# Altium project LimeSDR-Micro_M.2_2280_1v2.PrjPcb (part 10 of 10)
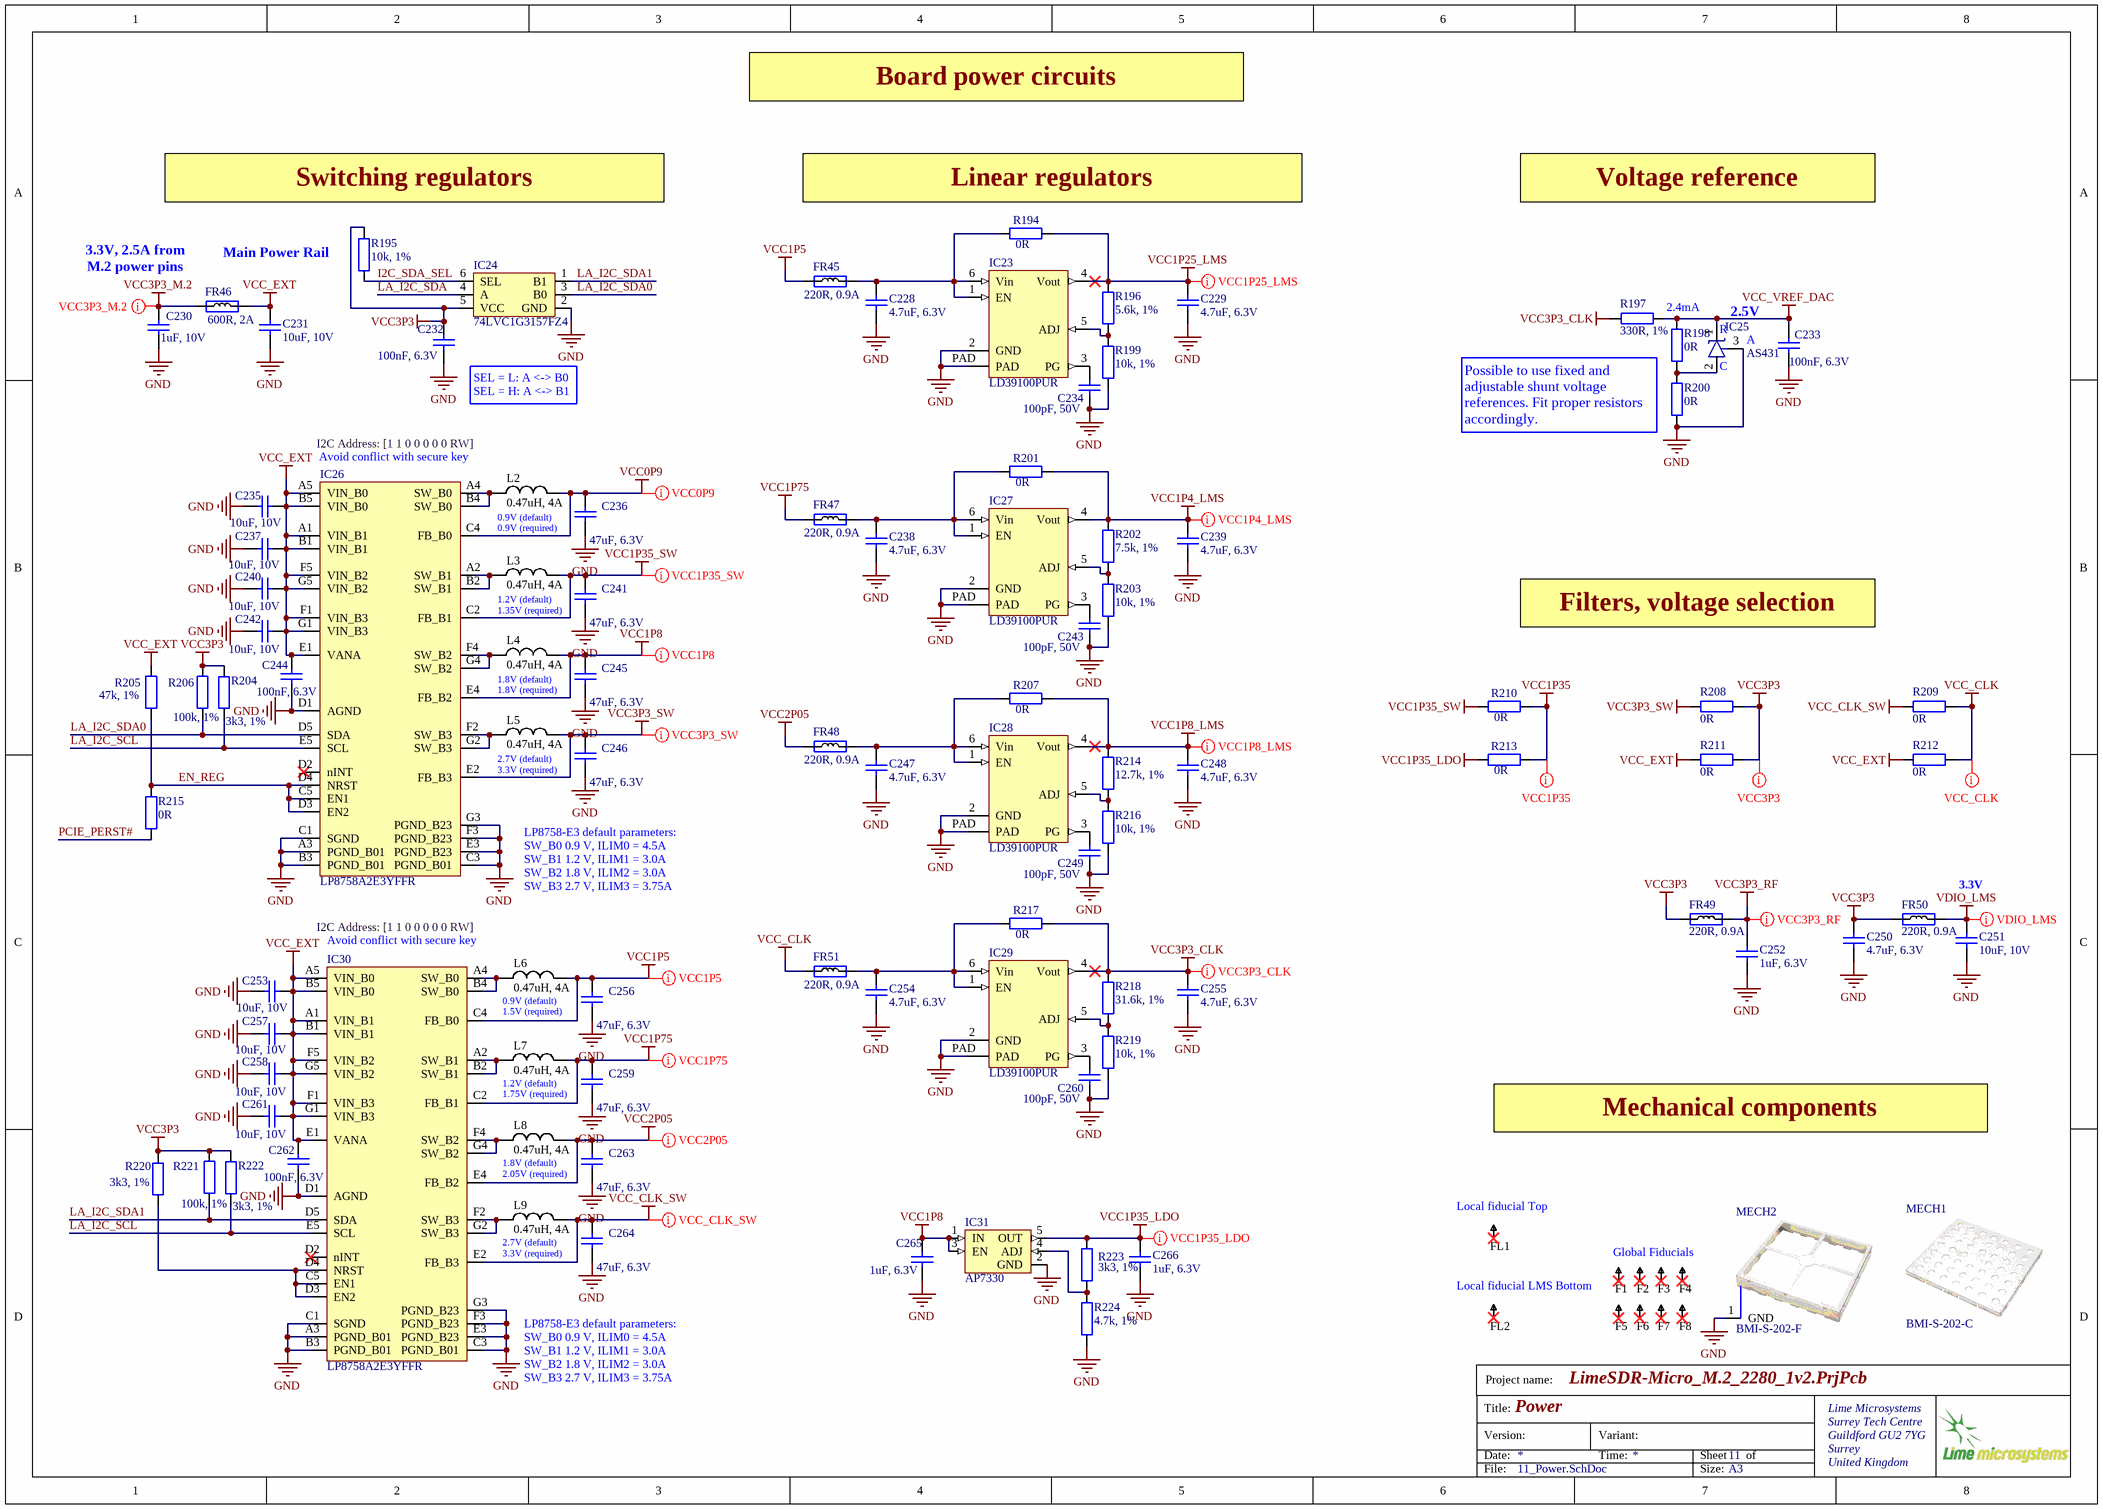
[diagram p108: 11_Power.SchDoc]

## Sheet 11_Power.SchDoc: Power (continued)

### Library data of the parts (continued)
R218 = Res_0402: Manufacturer: Yageo; Manufacturer Part Number 1: RC0201FR-0731K6L; Part Description: 31.6 kOhms ±1% 0.05W, 1/20W Chip Resistor 0201 (0603 Metric) Moisture Resistant Thick Film; Resistance: 31.6kR; Max Power Dissipation: 50mW; Temperature Coefficient: 200ppm/°C; Value: 31.6k, 1%; ComponentLink1URL: https://datasheet.ciiva.com/5924/1563626-5924912.pdf?src-supplier=Farnell; ComponentLink1Description: https://datasheet.ciiva.com/5924/1563626-5924912.pdf?src-supplier=Farnell; ComponentLink2URL: https://datasheet.ciiva.com/22661/1563626-22661319.pdf?src-supplier=Element14; ComponentLink2Description: https://datasheet.ciiva.com/22661/1563626-22661319.pdf?src-supplier=Element14; ComponentLink3URL: https://datasheet.ciiva.com/7660/1421516-7660807.pdf?src-supplier=Element14; ComponentLink3Description: https://datasheet.ciiva.com/7660/1421516-7660807.pdf?src-supplier=Element14; ComponentLink4URL: https://datasheet.ciiva.com/46391/1421516-46391339.pdf?src-supplier=Element14; ComponentLink4Description: https://datasheet.ciiva.com/46391/1421516-46391339.pdf?src-supplier=Element14; ComponentLink5URL: https://datasheet.ciiva.com/2467/pyu-r-int-thick-7-2467110.pdf?src-supplier=Digi-Key; ComponentLink5Description: https://datasheet.ciiva.com/2467/pyu-r-int-thick-7-2467110.pdf?src-supplier=Digi-Key; ComponentLink6URL: https://datasheet.ciiva.com/2467/pyu-r-int-thick-7-2467111.pdf?src-supplier=Digi-Key; ComponentLink6Description: https://datasheet.ciiva.com/2467/pyu-r-int-thick-7-2467111.pdf?src-supplier=Digi-Key; ComponentLink7URL: https://datasheet.ciiva.com/2467/pyu-r-int-thick-7-2467109.pdf?src-supplier=Digi-Key; ComponentLink7Description: https://datasheet.ciiva.com/2467/pyu-r-int-thick-7-2467109.pdf?src-supplier=Digi-Key; Supplier 1: Digi-Key; Supplier Part Number 1: YAG2597CT-ND; Stock 1: 255391; Pricing 1: 1=0,10000, 10=0,03700, 100=0,01500, 1000=0,00672, 2500=0,00583, 5000=0,00482 (USD); RoHS: Yes; Case/Package: 0201; Case Code (Metric): 0603; Case Code (Imperial): 0201; Min Operating Temperature: -55°C; Max Operating Temperature: 125°C; Packaging: Tape and Reel; Resistor Type: Thick Film; Number of Terminations: 2; Tolerance: 1%; Features: Moisture Resistant; Length: 0.024inch; Width: 0.012inch; Height: 0.01inch; RoHS Compliant: Yes; ComponentLink8URL: http://www.yageo.com/documents/recent/PYu-RC_Group_51_RoHS_L_10.pdf?src-supplier=Digi-Key; ComponentLink8Description: http://www.yageo.com/documents/recent/PYu-RC_Group_51_RoHS_L_10.pdf?src-supplier=Digi-Key; ComponentLink9URL: https://www.yageo.com/upload/media/product/productsearch/datasheet/rchip/PYu-RC_Group_51_RoHS_L_11.pdf?src-supplier=Digi-Key; ComponentLink9Description: https://www.yageo.com/upload/media/product/productsearch/datasheet/rchip/PYu-RC_Group_51_RoHS_L_11.pdf?src-supplier=Digi-Key; ComponentLink10URL: http://www.yageo.com/documents/recent/PYu-RC_Group_51_RoHS_L_9.pdf?src-supplier=Digi-Key; ComponentLink10Description: http://www.yageo.com/documents/recent/PYu-RC_Group_51_RoHS_L_9.pdf?src-supplier=Digi-Key
R224 = Res_0402: Manufacturer: Yageo; Manufacturer Part Number 1: RC0201FR-074K7L; Part Description: 4.7 kOhms ±1% 0.05W, 1/20W Chip Resistor 0201 (0603 Metric) Moisture Resistant Thick Film; Resistance: 4.7kR; Power Rating: 50mW; Voltage Rating: 25V; Temperature Coefficient: 200ppm/°C; Value: 4.7k, 1%; ComponentLink1URL: https://datasheet.ciiva.com/5924/1563626-5924912.pdf?src-supplier=Farnell; ComponentLink1Description: https://datasheet.ciiva.com/5924/1563626-5924912.pdf?src-supplier=Farnell; ComponentLink2URL: https://datasheet.ciiva.com/22661/1563626-22661319.pdf?src-supplier=Element14; ComponentLink2Description: https://datasheet.ciiva.com/22661/1563626-22661319.pdf?src-supplier=Element14; ComponentLink3URL: https://datasheet.ciiva.com/7672/1563626-7672202.pdf?src-supplier=Element14; ComponentLink3Description: https://datasheet.ciiva.com/7672/1563626-7672202.pdf?src-supplier=Element14; ComponentLink4URL: https://datasheet.ciiva.com/2493/pyu-r-int-thick-7-2493785.pdf?src-supplier=Digi-Key; ComponentLink4Description: https://datasheet.ciiva.com/2493/pyu-r-int-thick-7-2493785.pdf?src-supplier=Digi-Key; ComponentLink5URL: https://datasheet.ciiva.com/2493/pyu-r-int-thick-7-2493786.pdf?src-supplier=Digi-Key; ComponentLink5Description: https://datasheet.ciiva.com/2493/pyu-r-int-thick-7-2493786.pdf?src-supplier=Digi-Key; ComponentLink6URL: https://datasheet.ciiva.com/2493/pyu-r-int-thick-7-2493784.pdf?src-supplier=Digi-Key; ComponentLink6Description: https://datasheet.ciiva.com/2493/pyu-r-int-thick-7-2493784.pdf?src-supplier=Digi-Key; ComponentLink7URL: https://datasheet.ciiva.com/7672/1563626-7672233.pdf?src-supplier=Element14; ComponentLink7Description: https://datasheet.ciiva.com/7672/1563626-7672233.pdf?src-supplier=Element14; ComponentLink8URL: https://datasheet.ciiva.com/2493/pyu-r-int-thick-7-2493812.pdf?src-supplier=Digi-Key; ComponentLink8Description: https://datasheet.ciiva.com/2493/pyu-r-int-thick-7-2493812.pdf?src-supplier=Digi-Key; ComponentLink9URL: https://datasheet.ciiva.com/2493/pyu-r-int-thick-7-2493813.pdf?src-supplier=Digi-Key; ComponentLink9Description: https://datasheet.ciiva.com/2493/pyu-r-int-thick-7-2493813.pdf?src-supplier=Digi-Key; ComponentLink10URL: https://datasheet.ciiva.com/2493/pyu-r-int-thick-7-2493811.pdf?src-supplier=Digi-Key; ComponentLink10Description: https://datasheet.ciiva.com/2493/pyu-r-int-thick-7-2493811.pdf?src-supplier=Digi-Key; ComponentLink11URL: https://datasheet.ciiva.com/8892/pyu-rc0201-51-rohs-l-8-8892942.pdf?src-supplier=Avnet; ComponentLink11Description: https://datasheet.ciiva.com/8892/pyu-rc0201-51-rohs-l-8-8892942.pdf?src-supplier=Avnet; Supplier 1: Digi-Key; Supplier Part Number 1: 311-4.70KMCT-ND; Stock 1: 6149397; Pricing 1: 1=0,10000, 10=0,03700, 100=0,01530, 1000=0,00685, 2500=0,00595, 5000=0,00491 (USD); RoHS: Yes; Case/Package: 0201; Case Code (Metric): 0603; Case Code (Imperial): 0201; Weight: 6E-06oz; Contact Plating: Tin,Matte; Size Code: 0201; Min Operating Temperature: -55°C; Max Operating Temperature: 125°C; Tolerance: 1%; Packaging: Tape and Reel; Package Quantity: 1; Resistor Type: Thick Film; Number of Terminations: 2; Termination: SMD/SMT; Max Power Dissipation: 50mW; Features: Moisture Resistant; Series: RC; Resistance Tolerance: 1%; Construction: Rectangular; Length: 0.6mm; Width: 0.012inch; Height: 0.01inch; Depth: 0.3mm; Radiation Hardening: No; Military Standard: Not; Lead Free: Lead Free; RoHS Compliant: Yes

## Nets that join several sheets
GND: 05_LMS7002M_Misc (42 pins), 07_LMS7002M_Power (85 pins), 08_BB_Processor (131 pins), 09_Misc (75 pins), 10_Clock (81 pins), 11_Power (73 pins)
VCC0P9: 08_BB_Processor (16 pins), 11_Power (C236.2 IC26.C4 L2.2)
VCC1P4_LMS: 07_LMS7002M_Power (5 pins), 11_Power (C239.2 IC27.4 R201.2 R202.1)
VCC1P8: 08_BB_Processor (13 pins), 09_Misc (32 pins), 10_Clock (6 pins), 11_Power (6 pins)
VCC1P8_LMS: 07_LMS7002M_Power (11 pins), 10_Clock (FR40.1), 11_Power (C248.2 IC28.4 R207.2 R214.1)
VCC1P25_LMS: 07_LMS7002M_Power (18 pins), 11_Power (C229.2 IC23.4 R194.2 R196.1)
VCC1P35: 08_BB_Processor (C117.1 R75.2), 11_Power (R210.2 R213.2)
VCC3P3: 05_LMS7002M_Misc (X6.8), 08_BB_Processor (X7.8), 09_Misc (22 pins), 11_Power (13 pins)
VCC3P3_CLK: 08_BB_Processor (C133.2 C134.1 IC7.1), 10_Clock (20 pins), 11_Power (5 pins)
VCC3P3_M.2: 08_BB_Processor (R74.1), 09_Misc (5 pins), 11_Power (C230.2 FR46.1)
VCC_VREF_DAC: 10_Clock (R168.2), 11_Power (C233.1 IC25.1 R197.1 R198.1)
VDIO_LMS: 05_LMS7002M_Misc (9 pins), 07_LMS7002M_Power (R69.1), 11_Power (C251.2 FR50.2)
ADF_MUXOUT: 09_Misc (IC14.24), 10_Clock (IC21.15 R186.1)
EXT_CLK_CTRL: 09_Misc (IC14.22), 10_Clock (IC16.30)
EXT_PPS_SEL: 09_Misc (IC14.26), 10_Clock (IC19.6)
GNSS_1PPS: 09_Misc (IC11.6), 10_Clock (R176.1)
GNSS_RXD_LS: 08_BB_Processor (IC6.P9), 09_Misc (IC12.3)
GNSS_TXD_LS: 08_BB_Processor (IC6.P10), 09_Misc (IC12.2)
I2C_SDA_SEL: 09_Misc (IC14.28), 11_Power (IC24.6 R195.1)
LA_CFG_BOOT_HO: 08_BB_Processor (IC6.R14), 09_Misc (R123.2 R132.1)
LA_CFG_BOOT_SRC0: 08_BB_Processor (IC6.M14), 09_Misc (JP1.1 R121.2 R130.1)
LA_CFG_BOOT_SRC1: 08_BB_Processor (IC6.P15), 09_Misc (IC8.4 R122.2 R129.1 R131.1)
LA_CFG_PCIE_GEN: 08_BB_Processor (IC6.P13), 09_Misc (R128.2 R137.1)
LA_CFG_RST_HNDSHK: 08_BB_Processor (IC6.P14), 09_Misc (IC9.1 R124.2 R133.1 R140.1)
LA_CFG_TEST_PORT_DIS: 08_BB_Processor (IC6.M15), 09_Misc (IC9.2 R125.2 R134.1 R138.1)
LA_GPIO_05: 08_BB_Processor (IC6.L13), 09_Misc (R141.1)
LA_GPIO_06: 08_BB_Processor (IC6.K15), 09_Misc (R142.1)
LA_I2C_SCL: 05_LMS7002M_Misc (R26.1), 09_Misc (9 pins), 10_Clock (IC18.5), 11_Power (IC26.E5 IC30.E5 R204.2 R222.2)
LA_I2C_SCL_LS: 08_BB_Processor (IC6.P6), 09_Misc (R116.2 R228.1 VT1.S)
LA_I2C_SDA: 05_LMS7002M_Misc (R30.1), 09_Misc (8 pins), 10_Clock (IC18.6), 11_Power (IC24.4)
LA_I2C_SDA_LS: 08_BB_Processor (IC6.R6), 09_Misc (R119.2 R227.1 VT2.S)
LA_LED1_LS: 08_BB_Processor (IC6.R11), 09_Misc (IC9.4)
LA_LED2_LS: 08_BB_Processor (IC6.P12), 09_Misc (IC9.3)
LA_PPS_IN_LS: 08_BB_Processor (IC6.K14), 10_Clock (IC20.4 R182.2)
LA_PPS_OUT_LS: 08_BB_Processor (IC6.M8), 09_Misc (R126.2 R135.1), 10_Clock (IC22.4 R193.2)
LA_RX0_I_N: 05_LMS7002M_Misc (C9.1 C10.1 R27.1 R29.1), 08_BB_Processor (IC6.A4)
LA_RX0_I_P: 05_LMS7002M_Misc (C10.2 C11.2 R32.2 R33.1), 08_BB_Processor (IC6.B4)
LA_RX0_Q_N: 05_LMS7002M_Misc (C14.1 C15.1 R36.1 R38.1), 08_BB_Processor (IC6.B6)
LA_RX0_Q_P: 05_LMS7002M_Misc (C15.2 C16.2 R40.2 R41.1), 08_BB_Processor (IC6.A6)
LA_RX1_I_N: 05_LMS7002M_Misc (C19.1 C20.1 R43.1 R45.1), 08_BB_Processor (IC6.B10)
LA_RX1_I_P: 05_LMS7002M_Misc (C20.2 C21.2 R47.2 R48.1), 08_BB_Processor (IC6.A10)
LA_RX1_Q_N: 05_LMS7002M_Misc (C24.1 C25.1 R50.1 R52.1), 08_BB_Processor (IC6.A12)
LA_RX1_Q_P: 05_LMS7002M_Misc (C25.2 C26.2 R56.2 R57.1), 08_BB_Processor (IC6.B12)
LA_SPI_ADF_SS: 09_Misc (IC12.12), 10_Clock (R191.2)
LA_SPI_ADF_SS_LS: 08_BB_Processor (IC6.P11), 09_Misc (IC12.1 R117.2)
LA_SPI_LMS_SS: 05_LMS7002M_Misc (R23.2), 09_Misc (IC12.9)
LA_SPI_LMS_SS_LS: 08_BB_Processor (IC6.P7), 09_Misc (IC12.4 R118.2)
LA_SPI_MISO: 05_LMS7002M_Misc (R22.2), 09_Misc (IC8.11)
LA_SPI_MISO_LS: 08_BB_Processor (IC6.R8), 09_Misc (IC8.2)
LA_SPI_MOSI: 05_LMS7002M_Misc (R21.2), 09_Misc (IC8.12), 10_Clock (R190.2)
LA_SPI_MOSI_LS: 08_BB_Processor (IC6.R9), 09_Misc (IC8.1 R127.2 R136.1)
LA_SPI_SCLK: 05_LMS7002M_Misc (R20.2), 09_Misc (IC8.10), 10_Clock (R188.2)
LA_SPI_SCLK_LS: 08_BB_Processor (IC6.P8), 09_Misc (IC8.3)
LA_TX_I_N: 05_LMS7002M_Misc (C2.1 C3.1 R4.1 R5.2), 08_BB_Processor (IC6.B7)
LA_TX_I_P: 05_LMS7002M_Misc (C1.2 C2.2 R1.2 R2.1), 08_BB_Processor (IC6.A7)
LA_TX_Q_N: 05_LMS7002M_Misc (C5.1 C6.1 R18.1 R19.2), 08_BB_Processor (IC6.B9)
LA_TX_Q_P: 05_LMS7002M_Misc (C4.2 C5.2 R14.2 R16.1), 08_BB_Processor (IC6.A9)
LMS_MCLK1: 05_LMS7002M_Misc (IC1.AB34 R7.1), 08_BB_Processor (R84.1)
LMS_RESET: 05_LMS7002M_Misc (IC1.E27 R10.1), 09_Misc (IC14.17)
LMS_RxPLL_CLK: 05_LMS7002M_Misc (IC1.AM24), 10_Clock (C197.2 R154.2)
LMS_TSTAO: 05_LMS7002M_Misc (IC1.B22), 09_Misc (R230.1)
LMS_TSTDO0: 05_LMS7002M_Misc (IC1.D22), 09_Misc (R231.1)
LMS_TSTDO1: 05_LMS7002M_Misc (IC1.F22), 09_Misc (R232.1)
LMS_TXEN: 05_LMS7002M_Misc (IC1.U29 R11.1), 09_Misc (IC9.11)
LMS_TxPLL_CLK: 05_LMS7002M_Misc (IC1.E5), 10_Clock (C196.2 R153.2)
M.2_CLK_IN: 09_Misc (X9.P28), 10_Clock (R155.2)
M.2_CLK_OUT: 09_Misc (X9.P24), 10_Clock (R160.2)
M.2_PPS_IN: 09_Misc (X9.P46), 10_Clock (R173.1)
M.2_PPS_OUT: 09_Misc (X9.P48), 10_Clock (R189.1)
PCIE_PER0_N: 08_BB_Processor (C125.1), 09_Misc (X9.P47)
PCIE_PER0_P: 08_BB_Processor (C118.1), 09_Misc (X9.P49)
PCIE_PERST#: 08_BB_Processor (D1.C R74.2), 09_Misc (R144.1 X9.P50), 11_Power (R215.1)
PCIE_PET0_N: 08_BB_Processor (C116.1), 09_Misc (X9.P41)
PCIE_PET0_P: 08_BB_Processor (C114.1), 09_Misc (X9.P43)
PCIE_REF_CLK_N: 08_BB_Processor (C113.1), 09_Misc (X9.P53)
PCIE_REF_CLK_P: 08_BB_Processor (C112.1), 09_Misc (X9.P55)
PCIE_W_DISABLE2#: 08_BB_Processor (R76.1), 09_Misc (R147.2 X9.P26)
SMB_CLK_CTRL: 09_Misc (IC14.23), 10_Clock (IC17.6 R159.1)

## Assembly variants
Default: not fitted C10 C15 C20 C25 C42 C44 C196 C197 C233 C234 C243 C249 C260 ESD4 FR1 FR1 IC2 IC15 IC29 J1 JMP1 JP1 MN4 MN5 MN12 MN17 MN18 MN19 MN20 MN25 MN26 MN27 MN28 MN39 MN40 MN41 R13 R26 R30 R31 R39 R46 R55 R74 R77 R78 R85 R88 R121 R126 R127 R131 R132 R133 R134 R137 R142 R144 R144 R151 R155 R158 R162 R164 R165 R166 R167 R169 R170 R171 R173 R179 R182 R183 R189 R193 R194 R200 R201 R204 R207 R208 R209 R210 R215 R218 R219 R222 R227 R228 R230 R231 R232 X3 XO2